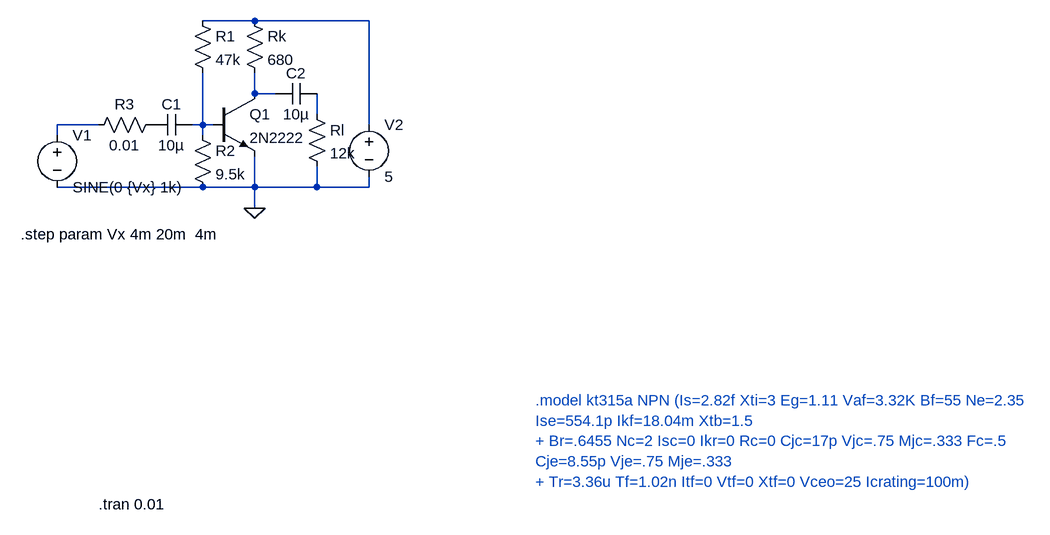
[diagram p0: schematic LAB4.asc]
LAB4.asc, the LTspice schematic file:
Version 4
SHEET 1 1512 728
WIRE 240 -32 160 -32
WIRE 416 -32 240 -32
WIRE 240 80 240 48
WIRE 272 80 240 80
WIRE 336 112 336 80
WIRE 0 128 -64 128
WIRE 160 128 160 48
WIRE 160 128 144 128
WIRE 176 128 160 128
WIRE 416 128 416 -32
WIRE -64 144 -64 128
WIRE 160 144 160 128
WIRE 160 224 -64 224
WIRE 240 224 240 176
WIRE 240 224 160 224
WIRE 336 224 336 192
WIRE 336 224 240 224
WIRE 416 224 416 208
WIRE 416 224 336 224
WIRE 240 256 240 224
FLAG 240 256 0
SYMBOL voltage -64 128 R0
WINDOW 123 0 0 Left 0
WINDOW 39 0 0 Left 0
SYMATTR InstName V1
SYMATTR Value SINE(0 {Vx} 1k)
SYMBOL voltage 416 112 R0
WINDOW 123 0 0 Left 0
WINDOW 39 0 0 Left 0
SYMATTR InstName V2
SYMATTR Value 5
SYMBOL cap 144 112 R90
WINDOW 0 0 32 VBottom 2
WINDOW 3 32 32 VTop 2
SYMATTR InstName C1
SYMATTR Value 10µ
SYMATTR SpiceLine V=2.5 Irms=0 Rser=0 Lser=0 mfg="Murata" pn="GRM155R60E106ME16" type="X5R"
SYMBOL res 144 -48 R0
SYMATTR InstName R1
SYMATTR Value 47k
SYMBOL res 224 -48 R0
SYMATTR InstName Rk
SYMATTR Value 680
SYMBOL res 144 128 R0
SYMATTR InstName R2
SYMATTR Value 9.5k
SYMBOL npn 176 80 R0
SYMATTR InstName Q1
SYMATTR Value 2N2222
SYMBOL cap 336 64 R90
WINDOW 0 0 32 VBottom 2
WINDOW 3 32 32 VTop 2
SYMATTR InstName C2
SYMATTR Value 10µ
SYMBOL res 320 96 R0
SYMATTR InstName Rl
SYMATTR Value 12k
SYMBOL res 96 112 R90
WINDOW 0 0 56 VBottom 2
WINDOW 3 32 56 VTop 2
SYMATTR InstName R3
SYMATTR Value 0.01
TEXT 672 552 Left 2 ;.model kt315a NPN (Is=2.82f Xti=3 Eg=1.11 Vaf=3.32K Bf=55 Ne=2.35\nIse=554.1p Ikf=18.04m Xtb=1.5\n+ Br=.6455 Nc=2 Isc=0 Ikr=0 Rc=0 Cjc=17p Vjc=.75 Mjc=.333 Fc=.5\nCje=8.55p Vje=.75 Mje=.333\n+ Tr=3.36u Tf=1.02n Itf=0 Vtf=0 Xtf=0 Vceo=25 Icrating=100m)
TEXT 0 712 Left 2 !.tran 0.01
TEXT -120 296 Left 2 !.step param Vx 4m 20m  4m

The netlist it stands for:
* LAB4.asc
V1 N004 0 SINE(0 {Vx} 1k)
V2 N001 0 5
C1 N005 P001 10µ V=2.5 Irms=0 Rser=0 Lser=0 mfg="Murata" pn="GRM155R60E106ME16" type="X5R"
R1 N001 N005 47k
Rk N001 N002 680
R2 N005 0 9.5k
Q1 N002 N005 0 0 2N2222
C2 N003 N002 10µ
Rl N003 0 12k
R3 P001 N004 0.01
.model NPN NPN
.model PNP PNP
.lib standard.bjt
* .model kt315a NPN (Is=2.82f Xti=3 Eg=1.11 Vaf=3.32K Bf=55 Ne=2.35
* Ise=554.1p Ikf=18.04m Xtb=1.5
* + Br=.6455 Nc=2 Isc=0 Ikr=0 Rc=0 Cjc=17p Vjc=.75 Mjc=.333 Fc=.5
* Cje=8.55p Vje=.75 Mje=.333
* + Tr=3.36u Tf=1.02n Itf=0 Vtf=0 Xtf=0 Vceo=25 Icrating=100m)
.tran 0.01
.step param Vx 4m 20m  4m
.backanno
.end